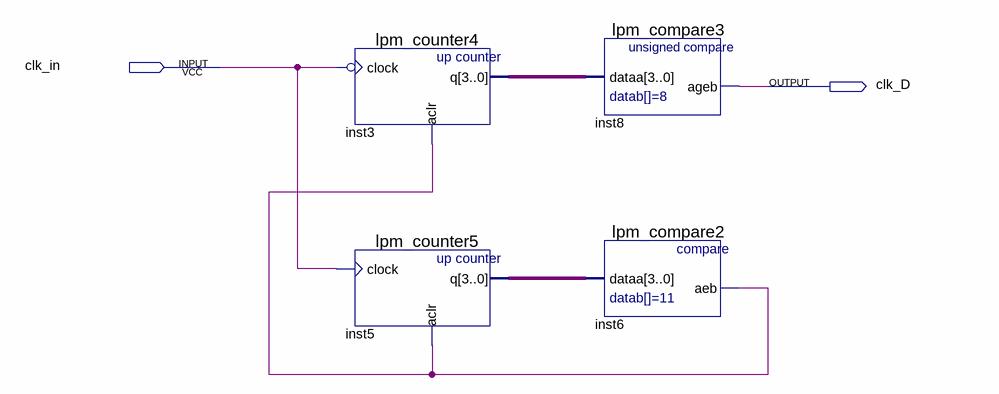
[diagram p0: schematic sheet]
// Quartus schematic scheme2.bdf as structural Verilog: 4 symbols, 2 pins
module scheme2 (
  input  clk_in,
  output clk_D
);

  wire inst6_aeb;
  wire [3:0] inst3_q, inst5_q;

  lpm_counter4 inst3 (.clock(~clk_in), .aclr(inst6_aeb), .q(inst3_q));
  lpm_counter5 inst5 (.clock(clk_in), .aclr(inst6_aeb), .q(inst5_q));
  lpm_compare3 inst8 (.dataa(inst3_q), .ageb(clk_D));
  lpm_compare2 inst6 (.dataa(inst5_q), .aeb(inst6_aeb));
endmodule
